# EAGLE design mixer 4x1 v1 (EAGLE 7.7.0)
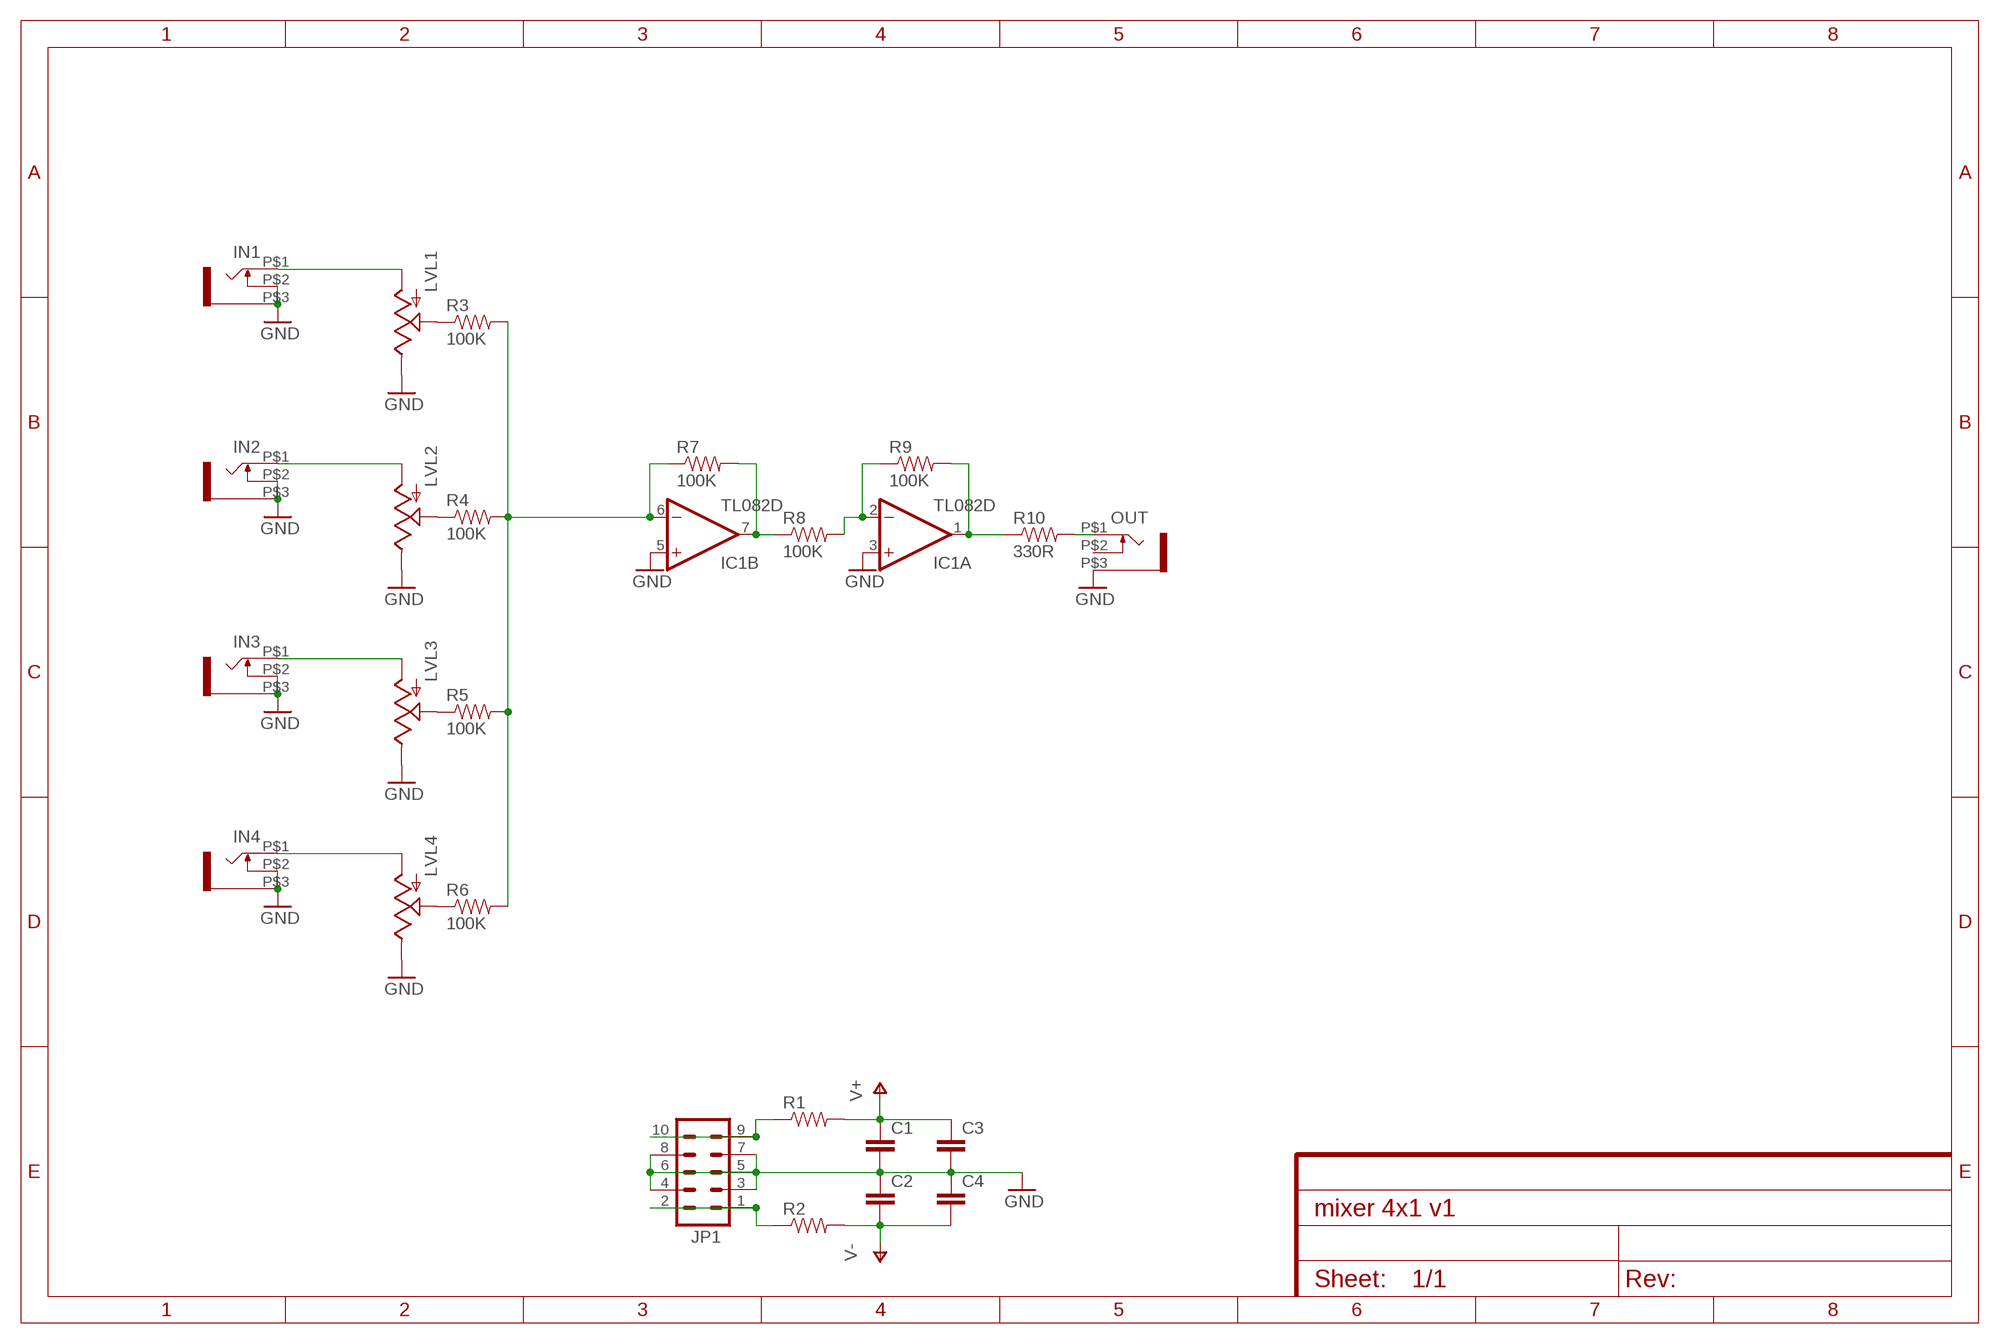
[diagram p0: schematic, sheet 1]

## Parts
C1  CAP1206  [1206]
C2  CAP1206  [1206]
C3  CAP0805  [0805]
C4  CAP0805  [0805]
IC1  TL082D  [SO08]
IN1  WQP-PJ301M-12_JACK  [WQP-PJ301M-12_JACK]
IN2  WQP-PJ301M-12_JACK  [WQP-PJ301M-12_JACK]
IN3  WQP-PJ301M-12_JACK  [WQP-PJ301M-12_JACK]
IN4  WQP-PJ301M-12_JACK  [WQP-PJ301M-12_JACK]
JP1  M05X2PTH  [AVR_ICSP]
LVL1  POT  [ALPS_POT]
LVL2  POT  [ALPS_POT]
LVL3  POT  [ALPS_POT]
LVL4  POT  [ALPS_POT]
OUT  WQP-PJ301M-12_JACK  [WQP-PJ301M-12_JACK]
R1  RESISTOR0805-RES  [0805]
R2  RESISTOR0805-RES  [0805]
R3  100K  RESISTOR0805-RES  [0805]
R4  100K  RESISTOR0805-RES  [0805]
R5  100K  RESISTOR0805-RES  [0805]
R6  100K  RESISTOR0805-RES  [0805]
R7  100K  RESISTOR0805-RES  [0805]
R8  100K  RESISTOR0805-RES  [0805]
R9  100K  RESISTOR0805-RES  [0805]
R10  330R  RESISTOR0805-RES  [0805]

## Nets
GND: C1.2 C2.1 C3.2 C4.1 IC1.3(A:+IN) IC1.5(B:+IN) IN1.P$2 IN1.P$3 IN2.P$2 IN2.P$3 IN3.P$2 IN3.P$3 IN4.P$2 IN4.P$3 JP1.3 JP1.4 JP1.5 JP1.6 JP1.7 JP1.8 LVL1.P$1(E) LVL2.P$1(E) LVL3.P$1(E) LVL4.P$1(E) OUT.P$3
N$1: LVL1.P$2(S) R3.1
N$2: IN2.P$1 LVL2.P$3(A)
N$3: JP1.9 JP1.10 R1.1
N$5: LVL2.P$2(S) R4.1
N$6: JP1.1 JP1.2 R2.1
N$7: IN3.P$1 LVL3.P$3(A)
N$9: IN1.P$1 LVL1.P$3(A)
N$11: LVL3.P$2(S) R5.1
N$12: IN4.P$1 LVL4.P$3(A)
N$14: LVL4.P$2(S) R6.1
N$21: IC1.6(B:-IN) R3.2 R4.2 R5.2 R6.2 R7.1
N$22: IC1.7(B:OUT) R7.2 R8.1
N$23: IC1.2(A:-IN) R8.2 R9.1
N$24: IC1.1(A:OUT) R9.2 R10.1
N$25: OUT.P$1 R10.2
V+: C1.1 C3.1 R1.2
V-: C2.2 C4.2 R2.2
Unconnected: OUT.P$2

## Power pins joined to a net without a drawn wire
V+: IC1.8(P:V+)
V-: IC1.4(P:V-)

## Library data of the parts
C1-C4 = SparkFun-Capacitors:CAP: Capacitor Standard 0603 ceramic capacitor, and 0.1" leaded capacitor.
IC1 = linear:TL082: OP AMP Data sheet <http://www.ti.com/lit/ds/symlink/tl084a . pdf>; DATA_SHEET: <a href="http://www.ti.com/lit/ds/symlink/tl084a.pdf"> Data sheet </a>
IN1-IN4 OUT = thonkiconn:WQP-PJ301M-12_JACK
JP1 = SparkFun-Connectors:M05X2: Header 5x2 Standard 10-pin dual row 0.1" header. Commonly used with AVR-ISP. Use with Spark Fun Electronics SKU: PRT-00778
LVL1-LVL4 = SparkFun-Electromechanical:POT; PROD_ID: RES-09177
R1 R2 = SparkFun-Resistors:RESISTOR: Resistor Basic schematic elements and footprints for 0603, 1206, and PTH resistors.
R3-R10 = SparkFun-Passives:RESISTOR: Resistor Basic schematic elements and footprints for 0603, 1206, and PTH resistors.

## Board
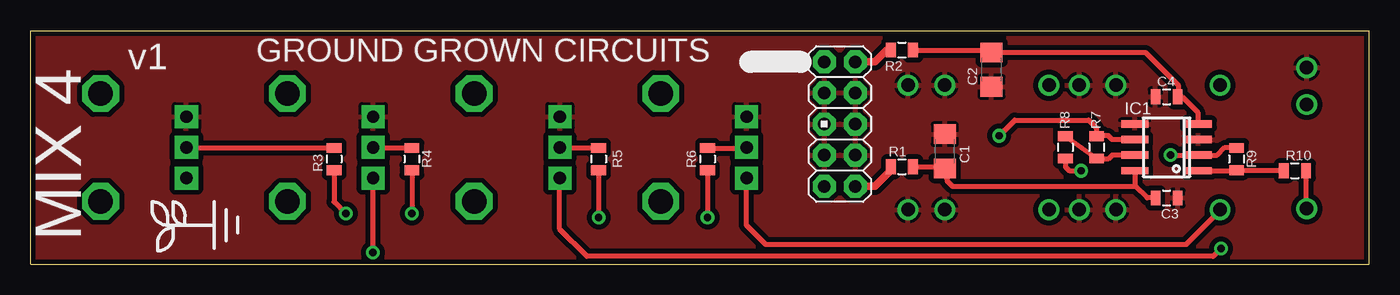
[diagram p1: board, top side]
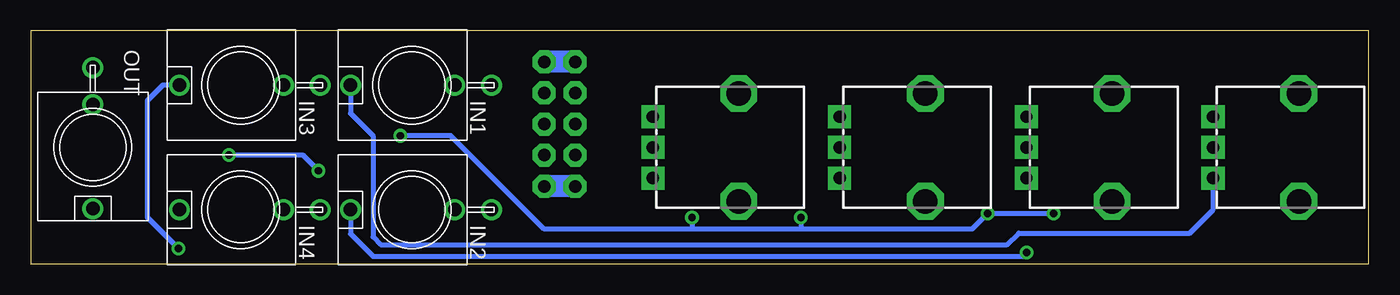
[diagram p2: board, bottom side, seen from below]

Size 109.22 x 19.05 mm. Coordinates in mm from the lower left corner, seen from the top.
Outline: 0,0 109.22,0 109.22,19.05 0,19.05 0,0
Copper layers (1*16): Top 0.035mm / dielectric 1.5mm / Bottom 0.035mm
Design rules "SparkFun": minimum track width 8mil, minimum drill 20mil, track to track 8mil, track to pad 8mil, pad to pad 8mil, via to via 8mil, smd to smd 8mil, copper to edge 8mil, drill to drill 8mil, minimum pad ring 12mil, minimum via ring 10mil, stop-mask expansion 4mil, vias tented up to drill 20mil, thermal gap 10mil

### Footprints (pad centres in the part's own frame; a part is rotated, then mirrored left to right if it is on the bottom)
1206 = smd 1.6 x 1.8: 1 -1.4,0; 2 1.4,0
0805 = smd 0.8 x 1.2: 1 -0.9,0; 2 0.9,0
SO08 = smd 0.6 x 2.2: 1 -1.905,-2.6; 2 -0.635,-2.6; 3 0.635,-2.6; 4 1.905,-2.6; 5 1.905,2.6; 6 0.635,2.6; 7 -0.635,2.6; 8 -1.905,2.6
WQP-PJ301M-12_JACK = drill 1.1: P$1 0,5; P$2 0,-3.5; P$3 0,-6.5
AVR_ICSP = drill 1.016 pad 1.88 octagon: 1 -1.27,5.08; 2 1.27,5.08; 3 -1.27,2.54; 4 1.27,2.54; 5 -1.27,0; 6 1.27,0; 7 -1.27,-2.54; 8 1.27,-2.54; 9 -1.27,-5.08; 10 1.27,-5.08
ALPS_POT = drill 1 pad 1.88 square: P$1 7,-2.5; P$2 7,0; P$3 7,2.5 | drill 2 octagon: P$4 0,-4.4; P$5 0,4.4

### Placement (x,y rotation side)
C1  74.61,9.21 90 top
C2  78.42,15.88 90 top
C3  92.71,5.4 0 top
C4  92.71,13.65 0 top
IC1  92.71,9.53 90 top
IN1  78.11,14.61 90 bottom
IN2  78.11,4.45 90 bottom
IN3  92.08,14.61 90 bottom
IN4  92.08,4.45 90 bottom
JP1  66.04,11.43 0 top
LVL1  5.71,9.53 180 bottom
LVL2  20.95,9.53 180 bottom
LVL3  36.2,9.53 180 bottom
LVL4  51.44,9.53 180 bottom
OUT  104.14,9.53 180 bottom
R1  71.12,7.94 0 top
R2  71.12,17.46 0 top
R3  24.77,8.57 270 top
R4  31.11,8.57 270 top
R5  46.35,8.57 270 top
R6  55.24,8.57 270 top
R7  87,9.53 270 top
R8  84.45,9.53 270 top
R9  98.42,8.57 270 top
R10  103.19,7.62 0 top
U$1  [LOGO_SMALL]  14.92,3.17 90 top

### Tracks (layer width: path | path; a pad name or v marks a point on that pad's centre or on a via)
GND
  pour Top (isolate 0.406): 0,0 109.22,0 109.22,19.05 0,19.05
N$1
  Top 0.406: R3.1 12.77,9.47 LVL1.P$2
N$2  (via drill 0.6)
  Top 0.406: v27.94,0.95 27.94,7.01 LVL2.P$3
  Bottom 0.406: IN2.P$1 83.11,2.46 81.28,0.64 28.26,0.64 v27.94,0.95
N$3
  Top 0.61: R1.1 70.22,7.67 68.9,6.35 JP1.10
  Bottom 1.778: JP1.9 JP1.10
N$5
  Top 0.406: R4.1 28.01,9.47 LVL2.P$2
N$6
  Top 0.61: R2.1 69.85,17.46 68.9,16.51 JP1.2
  Bottom 1.778: JP1.1 JP1.2
N$7  (via drill 0.6)
  Top 0.406: v97.16,1.27 96.52,0.64 45.4,0.64 43.18,2.86 43.18,7.01 LVL3.P$3
  Bottom 0.406: IN3.P$1 98.42,14.61 99.69,13.34 99.69,3.81 v97.16,1.27
N$9
  Bottom 0.406: IN1.P$1 83.11,12.3 81.28,10.48 81.28,2.22 80.64,1.59 29.53,1.59 28.57,2.54 14.61,2.54 12.7,4.45 12.7,7.01 LVL1.P$3
N$11
  Top 0.406: R5.1 43.25,9.47 LVL3.P$2
N$12
  Top 0.406: IN4.P$1 97.08,4.37 94.3,1.59 60.01,1.59 58.42,3.17 58.42,7.01 LVL4.P$3
N$14
  Top 0.406: R6.1 58.38,9.47 LVL4.P$2
N$21  (via drill 0.6)
  Top 0.406: R3.2 24.77,5.08 v25.72,4.13 | R4.2 v31.11,4.13 | v79.06,10.48 80.33,11.75 86.36,11.75 87,11.11 R7.1 87.05,10.48 87.95,10.48 88.27,10.16 IC1.6 | R5.2 v46.35,3.81 | R6.2 v55.24,3.81
  Bottom 0.406: v25.72,4.13 v31.11,4.13 32.38,2.86 46.35,2.86 | 46.35,2.86 55.24,2.86 | 55.24,2.86 67.31,2.86 74.93,10.48 v79.06,10.48 | v46.35,3.81 46.35,2.86 | v55.24,3.81 55.24,2.86
N$22
  Top 0.406: R8.1 R7.2 87.05,8.57 87.95,8.57 88.27,8.89 IC1.7
N$23  (via drill 0.6)
  Top 0.406: R9.1 98.37,9.53 97.47,9.53 96.84,8.89 IC1.2 v93.03,8.89 | R8.2 84.45,7.94 84.77,7.62 v85.72,7.62
  Bottom 0.406: v85.72,7.62 87,8.89 v93.03,8.89
N$24
  Top 0.406: IC1.1 98.37,7.62 R9.2 102.23,7.67 R10.1
N$25
  Top 0.406: R10.2 104.09,4.58 OUT.P$1
V+
  Top 0.406: 90.17,6.35 75.25,6.35 74.8,6.8 C1.1 74.48,7.94 R1.2 | 90.17,6.35 90.17,7.56 IC1.8 | C3.1 91.12,5.4 90.17,6.35
V-
  Top 0.406: R2.2 78.23,17.46 C2.2 90.99,17.27 93.66,14.61 93.66,13.71 C4.2 93.98,13.65 95.25,12.38 95.25,11.49 IC1.4

### Text on the board
tPlace: GROUND GROWN CIRCUITS | v1 | MIX 4